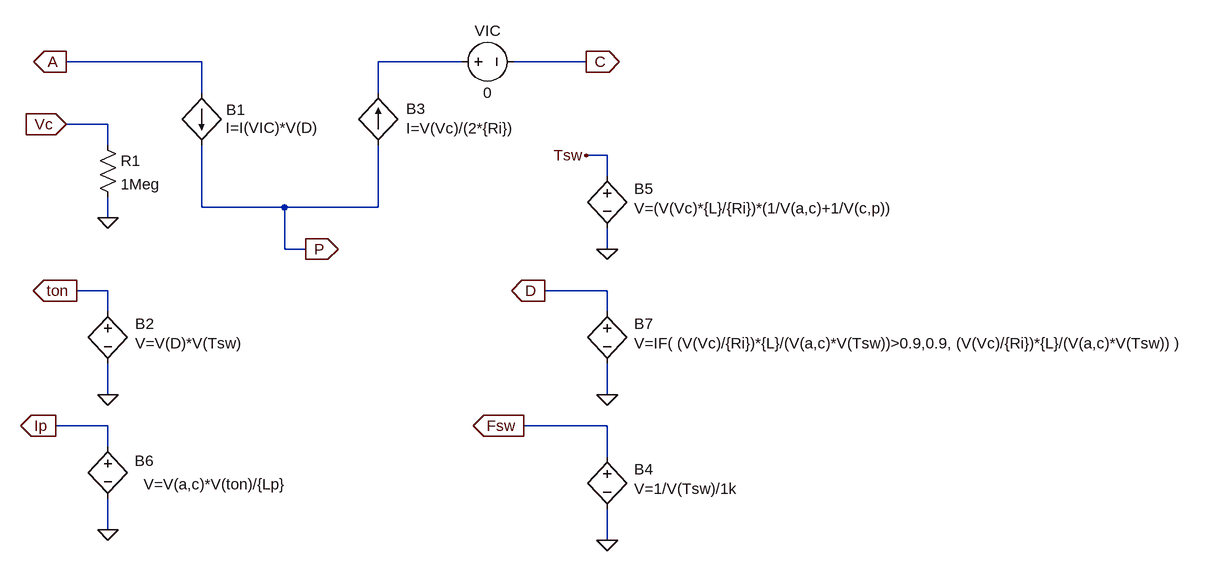
[diagram p0: schematic PWMBCMCM.asc]
PWMBCMCM.asc, the LTspice schematic file:
Version 4.1
SHEET 1 2736 884
WIRE 336 -80 128 -80
WIRE 736 -80 608 -80
WIRE 928 -80 816 -80
WIRE 336 -32 336 -80
WIRE 608 -32 608 -80
WIRE 192 16 128 16
WIRE 192 48 192 16
WIRE 960 64 928 64
WIRE 960 96 960 64
WIRE 336 144 336 48
WIRE 464 144 336 144
WIRE 608 144 608 48
WIRE 608 144 464 144
WIRE 192 160 192 128
WIRE 464 208 464 144
WIRE 496 208 464 208
WIRE 960 208 960 176
WIRE 192 272 144 272
WIRE 960 272 864 272
WIRE 192 304 192 272
WIRE 960 304 960 272
WIRE 192 432 192 384
WIRE 960 432 960 384
WIRE 192 480 112 480
WIRE 960 480 832 480
WIRE 192 512 192 480
WIRE 960 528 960 480
WIRE 192 640 192 592
WIRE 960 656 960 608
FLAG 192 432 0
FLAG 128 -80 A
IOPIN 128 -80 Out
FLAG 928 -80 C
IOPIN 928 -80 Out
FLAG 496 208 P
IOPIN 496 208 Out
FLAG 144 272 ton
IOPIN 144 272 Out
FLAG 960 432 0
FLAG 864 272 D
IOPIN 864 272 Out
FLAG 832 480 Fsw
IOPIN 832 480 Out
FLAG 960 656 0
FLAG 192 160 0
FLAG 128 16 Vc
IOPIN 128 16 In
FLAG 960 208 0
FLAG 928 64 Tsw
FLAG 192 640 0
FLAG 112 480 Ip
IOPIN 112 480 Out
SYMBOL bi 336 -32 R0
WINDOW 0 38 26 Left 2
WINDOW 3 37 53 Left 2
SYMATTR InstName B1
SYMATTR Value I=I(VIC)*V(D)
SYMBOL bv 192 288 R0
WINDOW 0 42 35 Left 2
WINDOW 3 42 65 Left 2
SYMATTR InstName B2
SYMATTR Value V=V(D)*V(Tsw)
SYMBOL voltage 720 -80 R270
WINDOW 0 32 56 VTop 2
WINDOW 3 -32 56 VBottom 2
WINDOW 123 0 0 Left 0
WINDOW 39 0 0 Left 0
SYMATTR InstName VIC
SYMATTR Value 0
SYMBOL bi 608 48 M180
WINDOW 0 43 56 Left 2
WINDOW 3 43 26 Left 2
SYMATTR InstName B3
SYMATTR Value I=V(Vc)/(2*{Ri})
SYMBOL bv 960 512 R0
WINDOW 0 42 35 Left 2
WINDOW 3 42 65 Left 2
SYMATTR InstName B4
SYMATTR Value V=1/V(Tsw)/1k
SYMBOL res 176 32 R0
SYMATTR InstName R1
SYMATTR Value 1Meg
SYMBOL bv 960 80 R0
WINDOW 0 42 35 Left 2
WINDOW 3 42 65 Left 2
SYMATTR InstName B5
SYMATTR Value V=(V(Vc)*{L}/{Ri})*(1/V(a,c)+1/V(c,p))
SYMBOL bv 192 496 R0
WINDOW 0 41 38 Left 2
WINDOW 3 55 74 Left 2
SYMATTR InstName B6
SYMATTR Value V=V(a,c)*V(ton)/{Lp}
SYMBOL bv 960 288 R0
WINDOW 0 42 35 Left 2
WINDOW 3 42 65 Left 2
SYMATTR InstName B7
SYMATTR Value V=IF( (V(Vc)/{Ri})*{L}/(V(a,c)*V(Tsw))>0.9,0.9, (V(Vc)/{Ri})*{L}/(V(a,c)*V(Tsw)) )

The netlist it stands for:
* PWMBCMCM.asc
B1 A P I=I(VIC)*V(D)
B2 ton 0 V=V(D)*V(Tsw)
VIC N001 C 0
B3 P N001 I=V(Vc)/(2*{Ri})
B4 Fsw 0 V=1/V(Tsw)/1k
R1 Vc 0 1Meg
B5 Tsw 0 V=(V(Vc)*{L}/{Ri})*(1/V(a,c)+1/V(c,p))
B6 Ip 0 V=V(a,c)*V(ton)/{Lp}
B7 D 0 V=IF( (V(Vc)/{Ri})*{L}/(V(a,c)*V(Tsw))>0.9,0.9, (V(Vc)/{Ri})*{L}/(V(a,c)*V(Tsw)) )
.backanno
.end